# EAGLE design servo_i2c_multi (EAGLE 4.16)
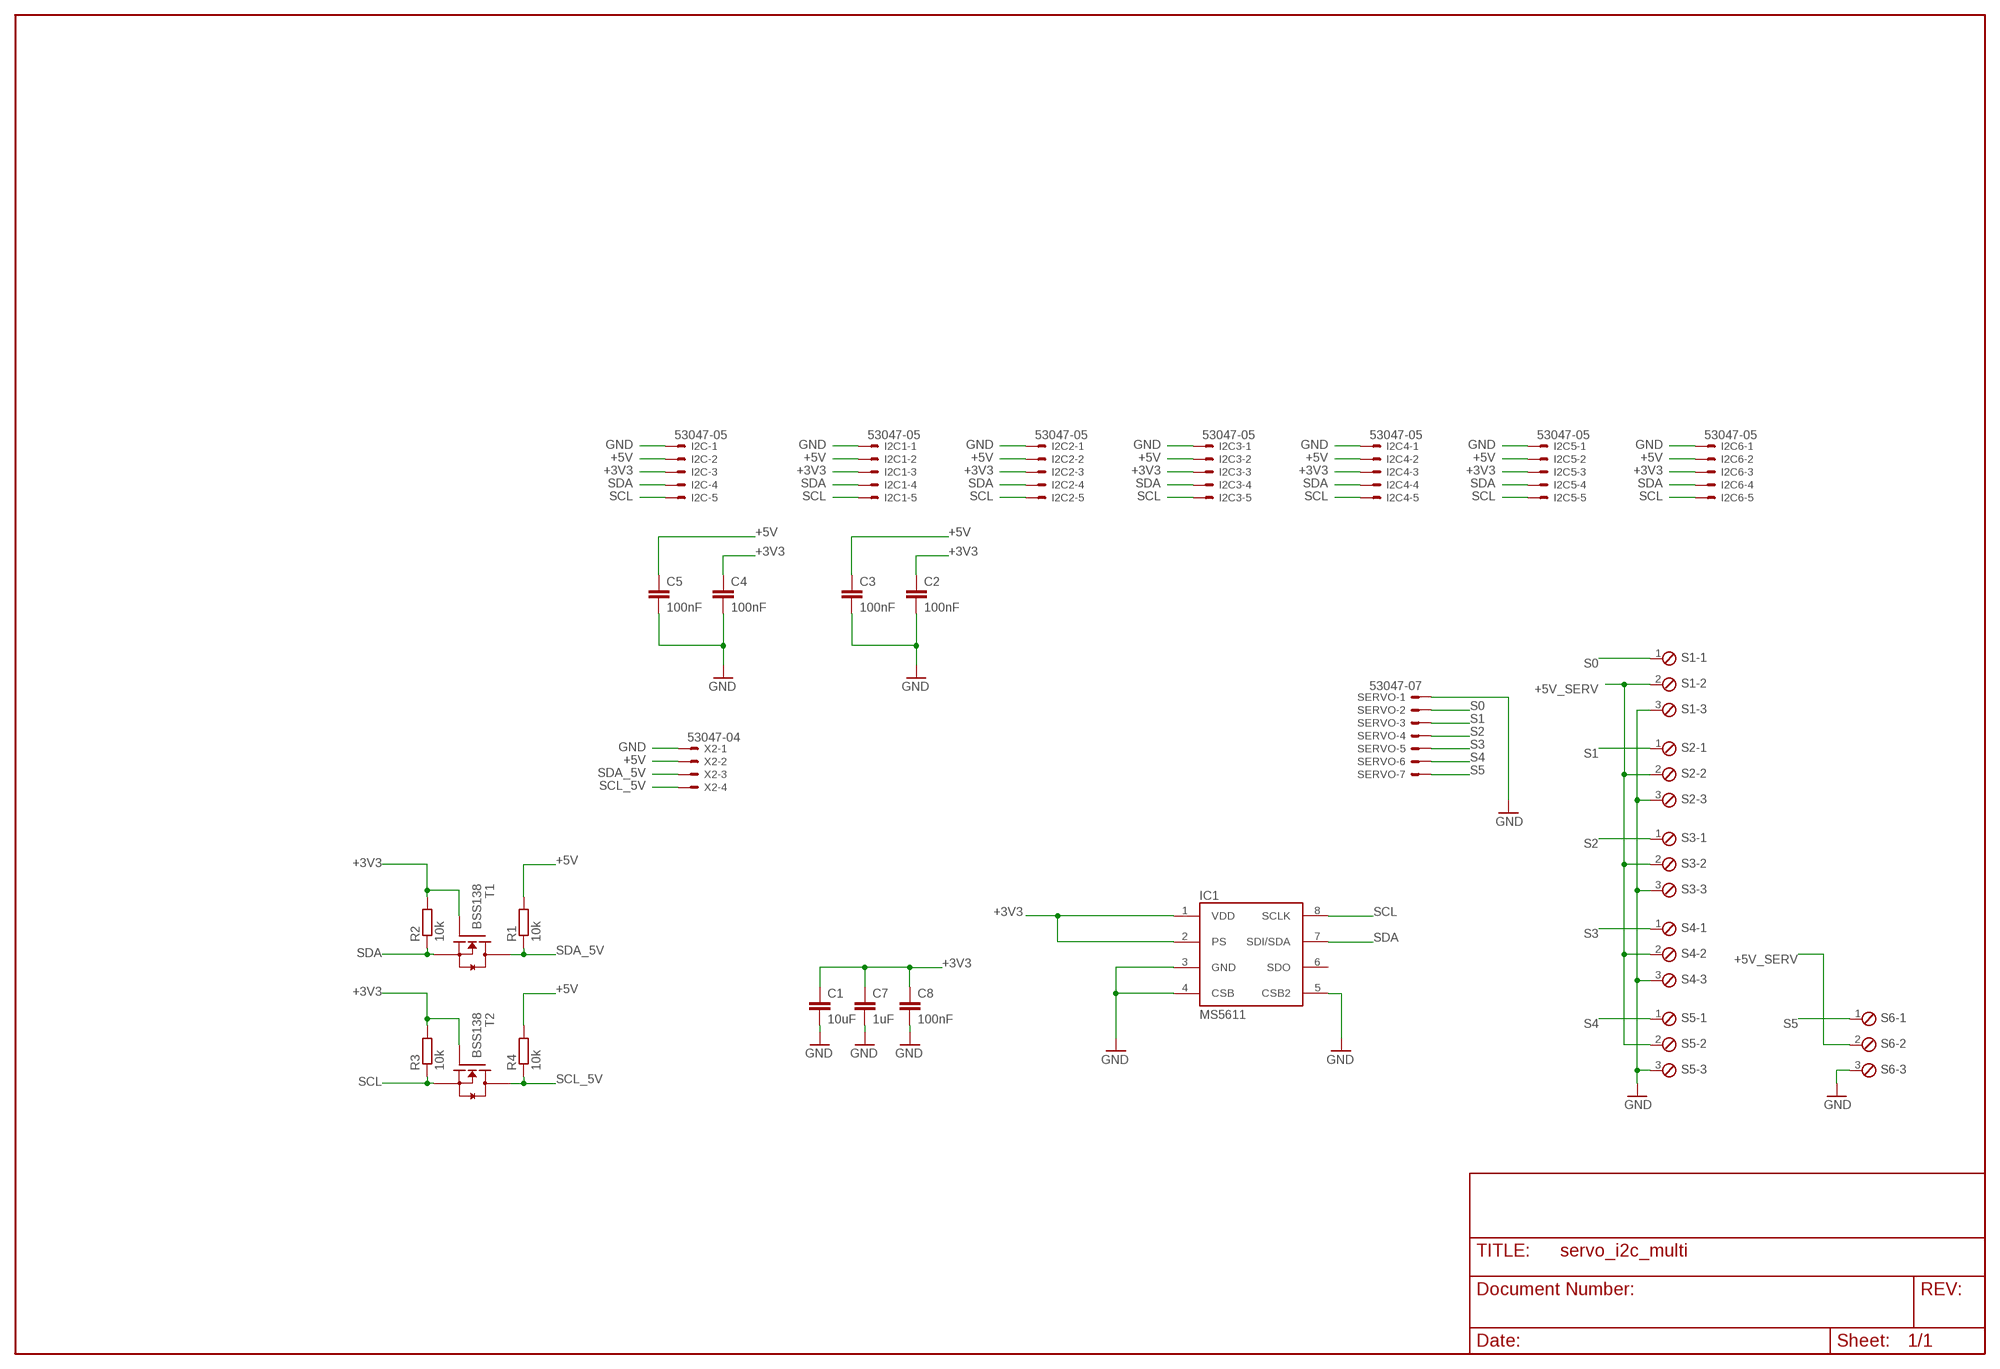
[diagram p0: schematic, sheet 1]

## Parts
C1  10uF  C-EUC1210  [C1210]
C2  100nF  C-EUC0603  [C0603]
C3  100nF  C-EUC0603  [C0603]
C4  100nF  C-EUC0603  [C0603]
C5  100nF  C-EUC0603  [C0603]
C7  1uF  C-EUC0603  [C0603]
C8  100nF  C-EUC0603  [C0603]
I2C  53047-05  [53047-05]
I2C1  53047-05  [53047-05]
I2C2  53047-05  [53047-05]
I2C3  53047-05  [53047-05]
I2C4  53047-05  [53047-05]
I2C5  53047-05  [53047-05]
I2C6  53047-05  [53047-05]
IC1  MS5611  [MS5611]
R1  10k  R-EU_R0603  [R0603]
R2  10k  R-EU_R0603  [R0603]
R3  10k  R-EU_R0603  [R0603]
R4  10k  R-EU_R0603  [R0603]
S1  MPT3  [3POL254]
S2  MPT3  [3POL254]
S3  MPT3  [3POL254]
S4  MPT3  [3POL254]
S5  MPT3  [3POL254]
S6  MPT3  [3POL254]
SERVO  53047-07  [53047-07]
T1  BSS138  [SOT23]
T2  BSS138  [SOT23]
X2  53047-04  [53047-04]

## Nets
+3V3: C1.1 C2.1 C4.1 C7.1 C8.1 I2C1.3 I2C2.3 I2C3.3 I2C4.3 I2C5.3 I2C6.3 I2C.3 IC1.1(VDD) IC1.2(PS) R2.2 R3.2 T1.1(G) T2.1(G)
+5V: C3.1 C5.1 I2C1.2 I2C2.2 I2C3.2 I2C4.2 I2C5.2 I2C6.2 I2C.2 R1.2 R4.2 X2.2
+5V_SERV: S1.2 S2.2 S3.2 S4.2 S5.2 S6.2
GND: C1.2 C2.2 C3.2 C4.2 C5.2 C7.2 C8.2 I2C1.1 I2C2.1 I2C3.1 I2C4.1 I2C5.1 I2C6.1 I2C.1 IC1.4(CSB) IC1.5(CSB2) S1.3 S2.3 S3.3 S4.3 S5.3 S6.3 SERVO.1 X2.1
S0: S1.1 SERVO.2
S1: S2.1 SERVO.3
S2: S3.1 SERVO.4
S3: S4.1 SERVO.5
S4: S5.1 SERVO.6
S5: S6.1 SERVO.7
SCL: I2C1.5 I2C2.5 I2C3.5 I2C4.5 I2C5.5 I2C6.5 I2C.5 IC1.8(SCLK) R3.1 T2.2(S)
SCL_5V: R4.1 T2.3(D) X2.4
SDA: I2C1.4 I2C2.4 I2C3.4 I2C4.4 I2C5.4 I2C6.4 I2C.4 IC1.7(SDI/SDA) R2.1 T1.2(S)
SDA_5V: R1.1 T1.3(D) X2.3
Unconnected: IC1.6(SDO)

## Power pins joined to a net without a drawn wire
GND: IC1.3(GND)

## Library data of the parts
C1-C5 C7 C8 = rcl:C-EU: CAPACITOR, European symbol
I2C I2C1-I2C6 = con-molex:53?-05: CONNECTOR wire to board 1.25 mm (.049 inch) pitch header
IC1 = paparazzi_mm:MS5611
R1-R4 = rcl:R-EU_: RESISTOR, European symbol
S1-S6 = paparazzi:MPT3: PHOENIX CONNECTOR
SERVO = con-molex:53?-07: CONNECTOR wire to board 1.25 mm (.049 inch) pitch header
T1 T2 = paparazzi_mm:BSS138
X2 = con-molex:53?-04: CONNECTOR wire to board 1.25 mm (.049 inch) pitch header

## Board
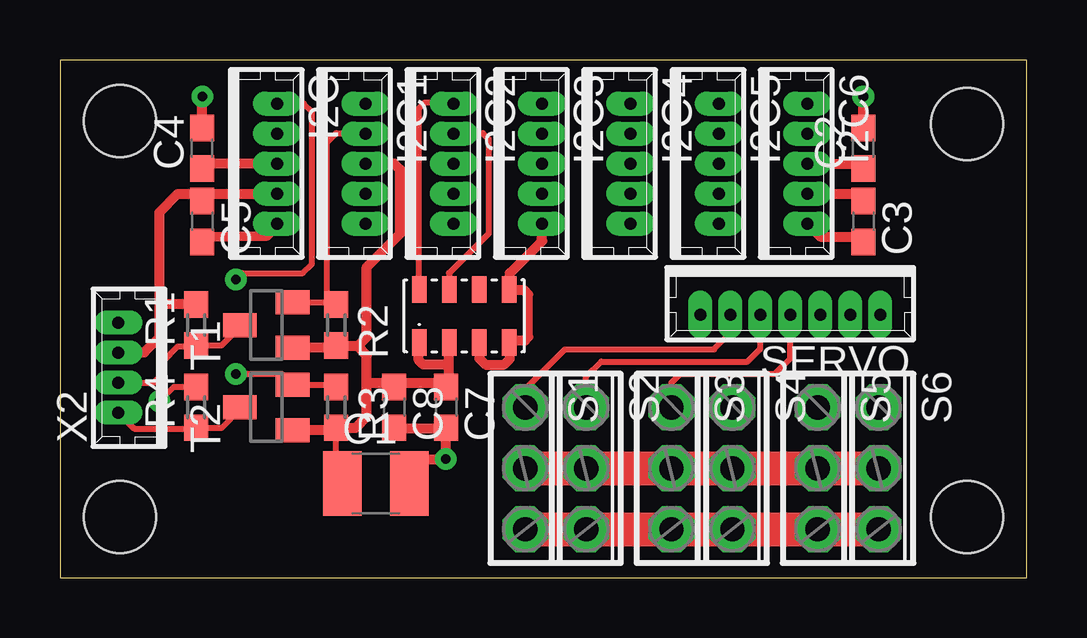
[diagram p1: board, top side]
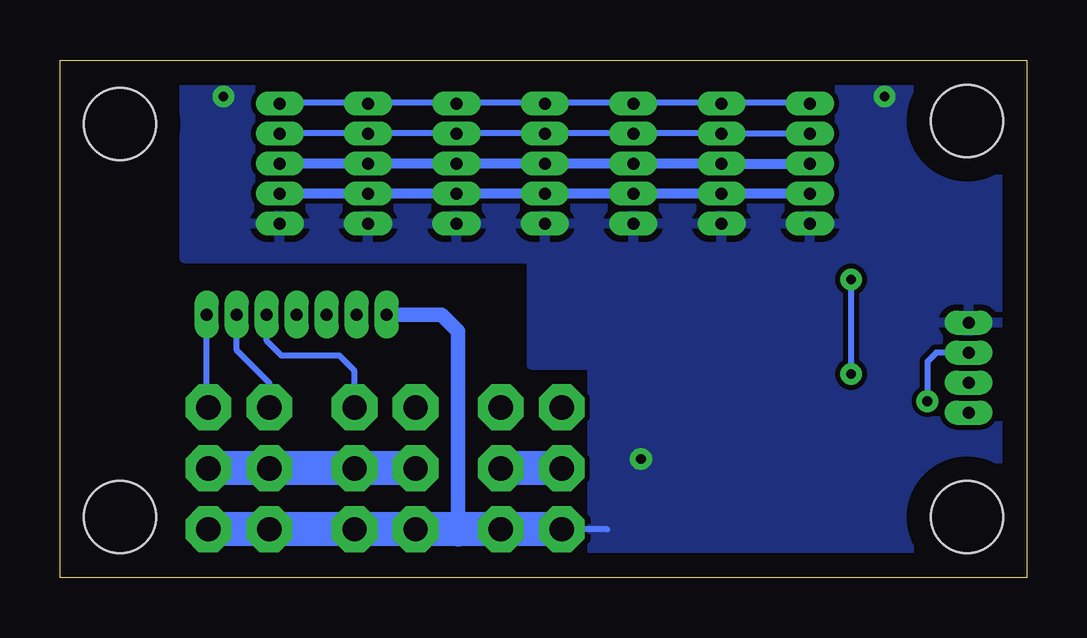
[diagram p2: board, bottom side, seen from below]

Size 40.31 x 21.57 mm. Coordinates in mm from the lower left corner, seen from the top.
Outline: 0,21.57 0,0 40.31,0 40.31,21.57 0,21.57
Copper layers (1*16): Top 0.035mm / dielectric 1.5mm / Bottom 0.035mm
Design rules "default": minimum track width 10mil, minimum drill 12mil, track to track 8mil, track to pad 8mil, pad to pad 8mil, via to via 8mil, smd to smd 8mil, copper to edge 40mil, drill to drill 8mil, minimum pad ring 10mil, minimum via ring 8mil, stop-mask expansion 4mil, vias tented up to drill 0mil, thermal gap 10mil
Holes 3 mm at 37.81,2.52 2.5,2.52 2.5,19.04 37.81,18.91

### Footprints (pad centres in the part's own frame; a part is rotated, then mirrored left to right if it is on the bottom)
C1210 = smd 1.6 x 2.7: 1 -1.4,0; 2 1.4,0
C0603 = smd 1.1 x 1: 1 -0.85,0; 2 0.85,0
53047-05 = drill 0.5 pad 0.698 long: 1 2.5,0.45; 2 1.25,0.45; 3 0,0.45; 4 -1.25,0.45; 5 -2.5,0.45
MS5611 = smd 1.1 x 0.6: 1 -1.1,1.875; 2 -1.1,0.625; 3 -1.1,-0.625; 4 -1.1,-1.875; 5 1.1,-1.875; 6 1.1,-0.625; 7 1.1,0.625; 8 1.1,1.875
R0603 = smd 1.1 x 1: 1 -0.85,0; 2 0.85,0
3POL254 = drill 1.016 pad 1.905 octagon: 1 -2.54,0; 2 0,0; 3 2.54,0
53047-07 = drill 0.5 pad 0.698 long: 1 3.75,0.45; 2 2.5,0.45; 3 1.25,0.45; 4 0,0.45; 5 -1.25,0.45; 6 -2.5,0.45; 7 -3.75,0.45
SOT23 = smd 1 x 1.4: 1 -0.95,-1.1; 2 0.95,-1.1; 3 0,1.1
53047-04 = drill 0.5 pad 0.698 long: 1 1.875,0.45; 2 0.625,0.45; 3 -0.625,0.45; 4 -1.875,0.45

### Placement (x,y rotation side)
C1  13.17,3.92 0 top
C2  33.49,17.89 90 top
C3  33.49,14.84 270 top
C4  5.93,17.89 90 top
C5  5.93,14.84 270 top
C7  16.09,7.1 270 top
C8  13.93,7.1 270 top
I2C  8.6,17.26 270 top
I2C1  12.28,17.26 270 top
I2C2  15.96,17.26 270 top
I2C3  19.65,17.26 270 top
I2C4  23.33,17.26 270 top
I2C5  27.01,17.26 270 top
I2C6  30.7,17.26 270 top
IC1  16.85,10.91 90 top
R1  5.68,10.53 90 top
R2  11.52,10.53 270 top
R3  11.52,7.1 270 top
R4  5.68,7.1 90 top
S1  19.39,4.56 270 top
S2  21.93,4.56 270 top
S3  25.49,4.56 270 top
S4  28.03,4.56 270 top
S5  31.59,4.56 270 top
S6  34.12,4.56 270 top
SERVO  30.44,11.41 180 top
T1  8.6,10.53 90 top
T2  8.6,7.1 90 top
X2  2.88,8.75 90 top

### Tracks (layer width: path | path; a pad name or v marks a point on that pad's centre or on a via)
+3V3
  Top 0.254: 16.09,8.11 C7.1 15.92,8.11 15.96,8.15 16.22,8.15 | 14.06,8.11 14.06,8.07 C8.1 13.89,8.11 | 12.66,17.26 I2C1.3 13.93,17.26 | 33.49,17.26 C2.1 | 5.93,17.26 C4.1 | C1.1 11.52,4.17 11.52,6.21 | 15.07,9.76 15.02,9.76 IC1.1 14.95,9.78 14.95,9.76 | 16.18,9.76 IC1.2 16.22,9.81
  Top 0.406: T1.1 11.39,9.58 11.39,9.68 R2.2 11.61,9.68 11.65,9.64 12.41,9.64 | T2.1 11.52,6.15 11.52,6.21 R3.2 12.32,6.25 12.79,6.72 12.79,8.11 | 12.79,8.11 12.79,9.26 12.41,9.64 | 14.06,8.11 15.92,8.11 | 12.41,9.64 12.79,10.02 12.79,12.94 14.19,14.34 14.19,17 13.93,17.26 | 12.79,8.11 13.89,8.11 | I2C6.3 33.49,17.26 | I2C.3 5.93,17.26 | 16.22,8.15 16.22,8.88 | 16.22,8.88 16.22,9.81 | 14.95,9.76 14.95,9.07 15.14,8.88 16.22,8.88
  Bottom 0.254: I2C4.3 23.71,17.26 | I2C3.3 20.03,17.26 | I2C2.3 16.34,17.26
  Bottom 0.406: I2C6.3 I2C5.3 I2C4.3 I2C3.3 I2C2.3 I2C1.3 I2C.3
+5V  (via drill 0.4 pad 0.9)
  Top 0.254: 4.15,11.29 4.15,11.41 | 7.29,15.99 7.33,15.99 | 5.64,11.41 R1.2 | R4.2 4.75,7.95 v4.15,7.35 | 2.5,9.38 2.49,9.37 X2.2 | C3.1 33.49,15.99 arc90 33.47,16.01 | 9.11,15.99 9.07,15.99 I2C.2 | C5.1 5.97,15.99
  Top 0.406: 4.15,11.41 5.64,11.41 | 2.5,9.38 3.52,9.38 4.15,10.02 4.15,11.29 4.15,15.22 4.92,15.99 5.93,15.99 | I2C6.2 33.47,16.01 | 9.07,15.99 7.29,15.99 5.93,15.99 | 5.93,15.99 C5.1
  Bottom 0.254: 12.79,15.99 12.75,15.99 I2C1.2 | I2C.2 9.07,15.99 | 16.47,15.99 16.43,15.99 I2C2.2 | 20.08,15.99 I2C3.2 20.12,15.99 | 23.76,15.99 I2C4.2 23.8,15.99 | 27.52,15.99 27.48,15.99 I2C5.2 | 31.13,15.99 I2C6.2 | X2.2 3.78,9.37 4.15,9 v4.15,7.35
  Bottom 0.406: 9.07,15.99 12.75,15.99 16.43,15.99 20.08,15.99 | 20.12,15.99 23.76,15.99 | 23.8,15.99 27.48,15.99 31.13,15.99
+5V_SERV
  Top 0.254: S2.2 21.81,4.56
  Top 1.422: 31.46,4.56 S4.2 S3.2 S2.2 S1.2 | S6.2 S5.2 31.59,4.68
  Bottom 0.254: S6.2 34.25,4.56
  Bottom 1.422: S5.2 31.46,4.56 | S5.2 S4.2 S3.2 | 19.27,4.56 S1.2 S2.2 | S5.2 S6.2
GND  (via drill 0.4 pad 0.9)
  Top 0.254: 13.93,6.21 C8.2 | C7.2 16.09,6.21 | 33.49,14.21 C3.2 | 9.11,14.72 9.07,14.76 I2C.1 | C1.2 14.57,4.94 | 18.76,11.98 18.76,11.92 | IC1.4 18.68,9.76 | IC1.3 17.52,9.76 | 18.76,11.99 18.76,12.01 IC1.5
  Top 0.406: 16.09,6.21 13.93,6.21 | I2C6.1 31.69,14.21 33.49,14.21 | C2.2 v33.49,20.05 | C5.2 5.93,14.21 8.64,14.25 9.11,14.72 | C4.2 v5.93,20.05 | 14.57,4.94 v16.09,4.94 C7.2 | I2C3.1 20.1,14.02 18.76,12.68 18.76,11.99 18.76,11.98 19.34,11.98 19.52,11.8 19.52,10.02 19.39,9.89 18.63,9.89 18.76,9.84 IC1.4 18.76,9.78 18.76,9.13 18.5,8.88 17.74,8.88 17.49,9.13 17.49,9.73 17.52,9.76
  Top 1.422: S6.3 S5.3 S4.3 S3.3 S2.3 S1.3
  Bottom 0.254: 17.49,2.02 S1.3 | 23.71,2.02 23.71,1.89
  Bottom 0.61: SERVO.1 24.4,10.96 23.71,10.27 23.71,2.02
  Bottom 1.422: S5.3 31.46,2.02 | S5.3 S4.3 S3.3 23.71,2.02 S2.3 | S2.3 21.81,2.02 | S1.3 S2.3 | S5.3 S6.3
  pour Bottom: 35.14,21.19 35.14,13.32 20.66,13.32 20.79,13.32 20.66,13.32 20.66,8.88 18.12,8.88 18.12,0.87 0.47,0.87 0.47,21.19
S0
  Top 0.254: SERVO.2 27.94,10.18 27.27,9.51 21.04,9.51 19.39,7.86 S1.1
S1
  Top 0.254: SERVO.3 29.19,9.53 28.66,9 22.57,9 21.93,8.37 S2.1
S2
  Top 0.254: SERVO.4 30.44,9.13 29.81,8.49 25.87,8.49 25.49,8.11 S3.1
S3
  Bottom 0.254: SERVO.5 31.69,9.87 31.08,9.26 28.66,9.26 28.03,8.62 S4.1 28.03,6.97
S4
  Bottom 0.254: SERVO.6 32.94,9.47 31.59,8.11 S5.1
S5
  Bottom 0.254: S6.1 34.25,7.1 34.19,7.16 SERVO.7
SCL  (via drill 0.4 pad 0.9)
  Top 0.254: 11.52,8.05 T2.2 9.25,8.49 v7.33,8.49 | I2C2.5 16.37,19.8 15.2,19.8 14.95,19.54 14.95,12.05 14.98,12.02 IC1.8 | I2C.5 10.16,19.76 10.5,19.42 10.5,13.07 10.12,12.68 7.58,12.68 v7.33,12.43
  Top 0.406: 11.52,8.05 R3.1
  Bottom 0.254: I2C6.5 31.11,19.8 27.5,19.8 I2C5.5 27.42,19.8 23.74,19.8 | 23.74,19.8 23.71,19.8 | 20.06,19.8 20.03,19.8 | 23.74,19.8 I2C4.5 | 20.06,19.8 23.74,19.8 | 16.37,19.8 16.34,19.8 | 16.37,19.8 I2C2.5 16.45,19.8 16.47,19.8 | 20.06,19.8 I2C3.5 | 16.47,19.8 16.37,19.8 | 16.47,19.8 20.06,19.8 | 16.47,19.8 12.77,19.8 I2C1.5 12.69,19.8 9.09,19.8 I2C.5 | v7.33,8.49 v7.33,12.43
SCL_5V
  Top 0.254: R4.1 6.73,6.25 7.5,7.01 | X2.4 3.1,6.21 5.68,6.21
  Top 0.406: 7.5,7.01 T2.3 | 5.68,6.21 R4.1
SDA
  Top 0.254: T1.2 11.52,11.48 | R2.1 11.14,11.76 11.14,18.15 11.52,18.53 12.71,18.53 I2C1.4 | I2C2.4 16.43,18.53 17.61,18.53 17.87,18.27 17.87,14.34 16.22,12.68 16.22,12.01 IC1.7
  Top 0.406: 11.52,11.48 R2.1
  Bottom 0.254: I2C.4 9.07,18.53 12.71,18.53 I2C1.4 12.75,18.53 16.43,18.53 | 16.43,18.53 I2C2.4 | 16.43,18.53 20.08,18.53 I2C3.4 20.12,18.53 23.8,18.53 | 23.8,18.53 23.84,18.53 | 27.48,18.53 27.52,18.53 | 23.8,18.53 I2C4.4 | 23.8,18.53 27.48,18.53 | I2C6.4 31.13,18.53 27.48,18.53 | 27.48,18.53 I2C5.4
SDA_5V
  Top 0.254: R1.1 6.73,9.68 7.5,10.44 | 2.44,8.11 3.9,8.11 4.28,8.49 4.28,9 4.92,9.64 5.55,9.64
  Top 0.406: 7.5,10.44 T1.3 | X2.3 2.44,8.11 | 5.55,9.64 5.59,9.68 R1.1